# EAGLE schematic Slave Mux (EAGLE 9.6.2)
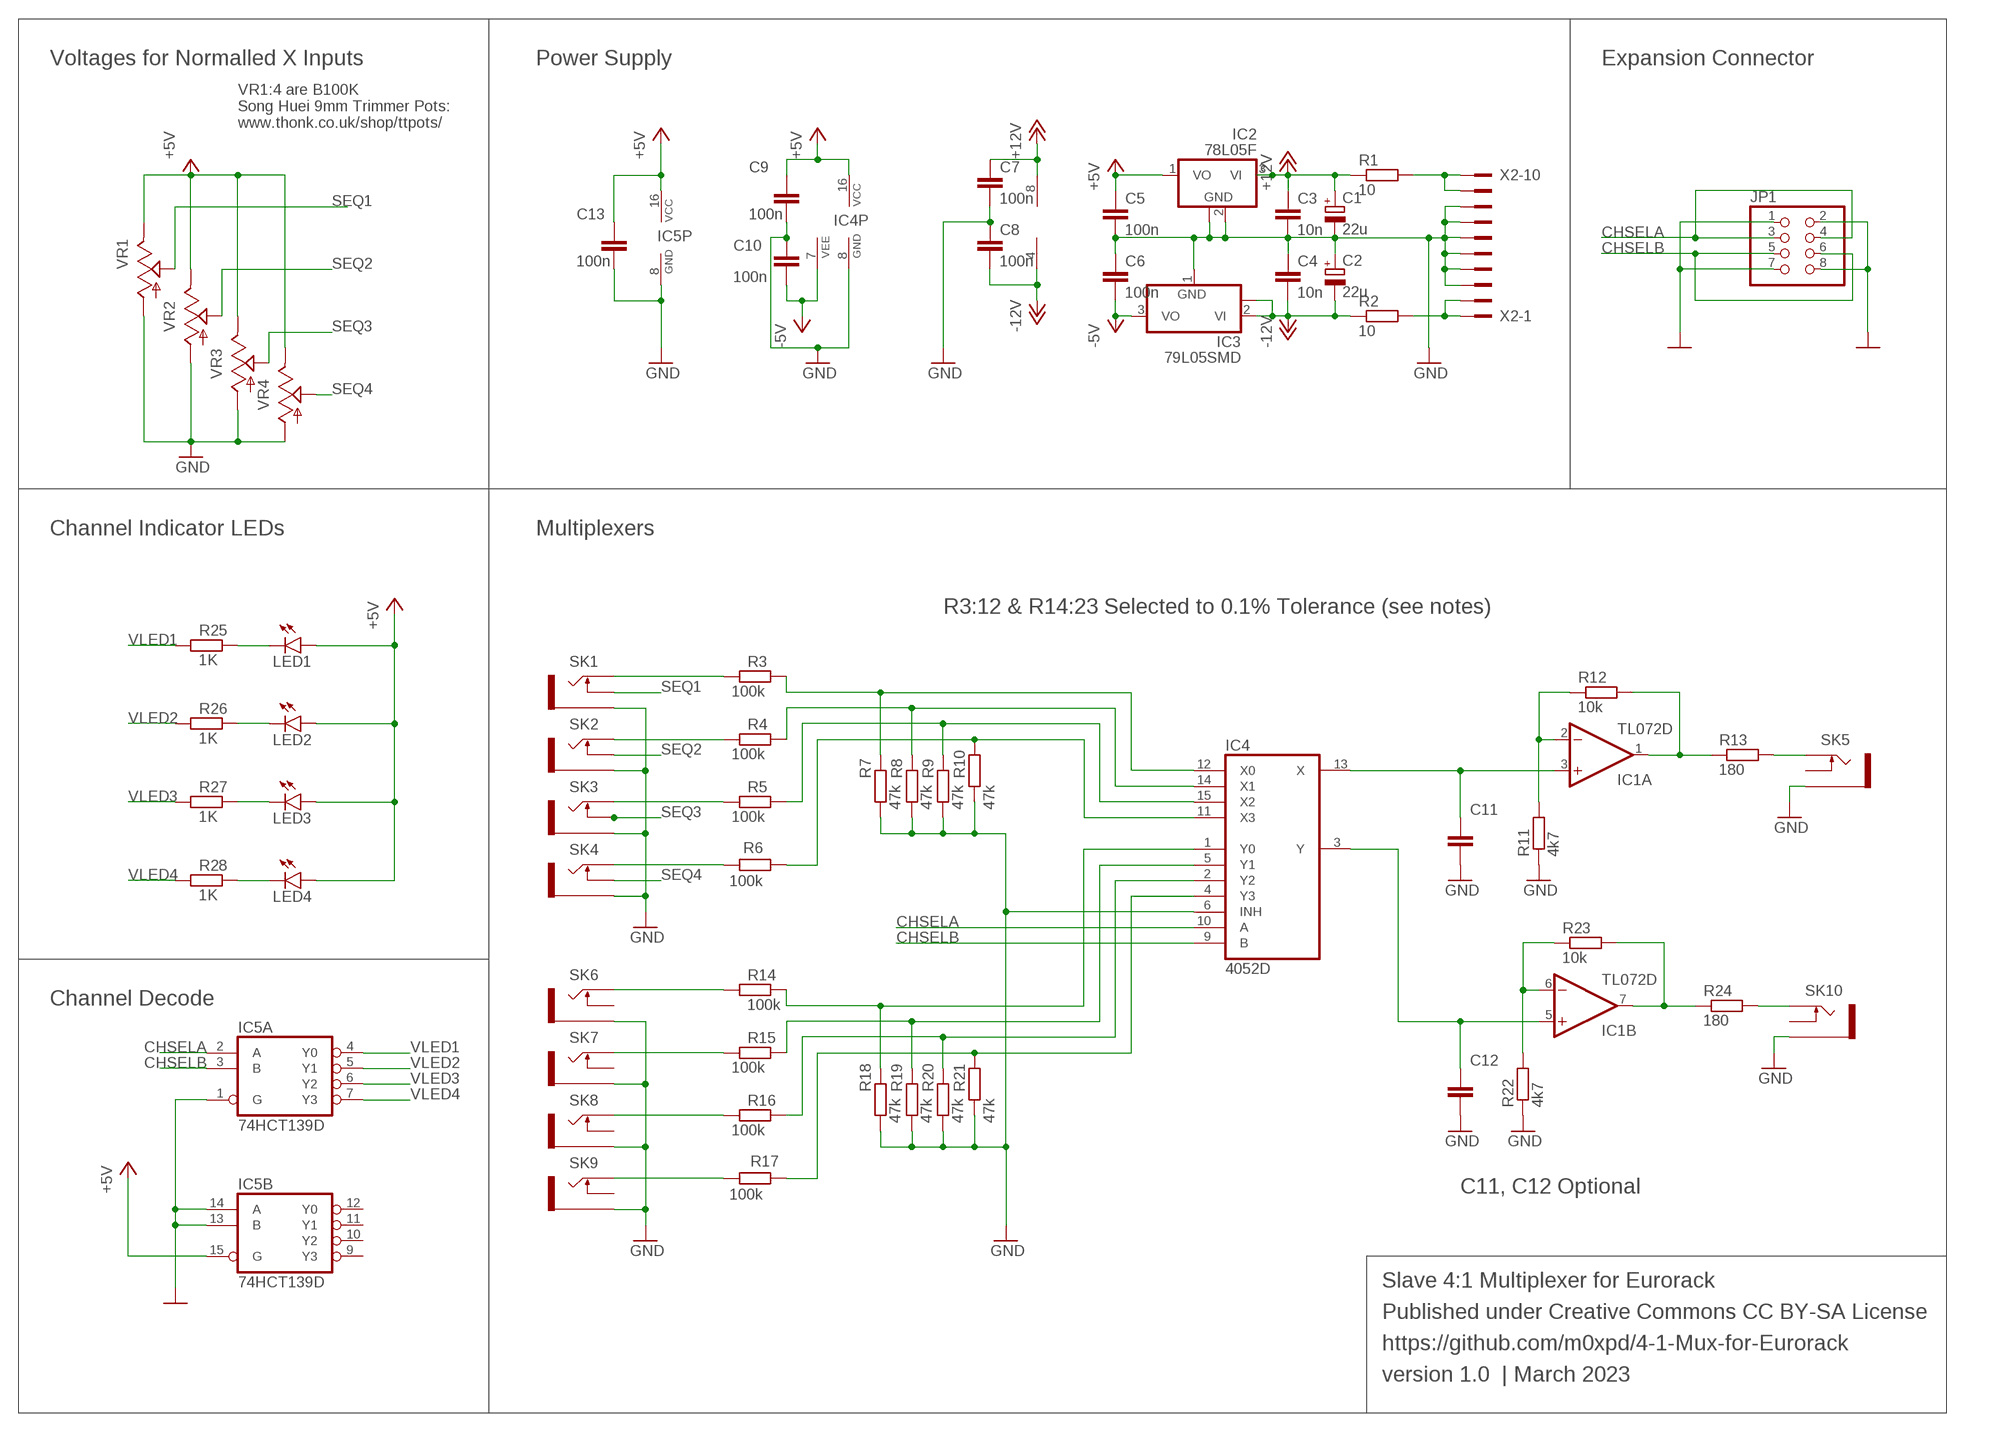
[diagram p0: schematic, sheet 1]

## Parts
C1  22u  CPOL-EU153CLV-0505  [153CLV-0505]
C2  22u  CPOL-EU153CLV-0505  [153CLV-0505]
C3  10n  C-EUC1206  [C1206]
C4  10n  C-EUC1206  [C1206]
C5  100n  C-EUC1206  [C1206]
C6  100n  C-EUC1206  [C1206]
C7  100n  C-EUC1206  [C1206]
C8  100n  C-EUC1206  [C1206]
C9  100n  C-EUC1206  [C1206]
C10  100n  C-EUC1206  [C1206]
C11  C-EUC1206  [C1206]
C12  C-EUC1206  [C1206]
C13  100n  C-EUC1206  [C1206]
IC1  TL072D  [SO08]
IC2  78L05F  [SOT89]
IC3  79L05SMD  [SOT89]
IC4  4052D  [SO16]
IC5  74HCT139D  [SO16]
JP1  PINHD-2X4  [2X04]
LED1  LED3MM  [LED3MM]
LED2  LED3MM  [LED3MM]
LED3  LED3MM  [LED3MM]
LED4  LED3MM  [LED3MM]
R1  10  R-EU_M1206  [M1206]
R2  10  R-EU_M1206  [M1206]
R3  100k  R-EU_M1206  [M1206]
R4  100k  R-EU_M1206  [M1206]
R5  100k  R-EU_M1206  [M1206]
R6  100k  R-EU_M1206  [M1206]
R7  47k  R-EU_M1206  [M1206]
R8  47k  R-EU_M1206  [M1206]
R9  47k  R-EU_M1206  [M1206]
R10  47k  R-EU_M1206  [M1206]
R11  4k7  R-EU_R1206  [R1206]
R12  10k  R-EU_R1206  [R1206]
R13  180  R-EU_M1206  [M1206]
R14  100k  R-EU_M1206  [M1206]
R15  100k  R-EU_M1206  [M1206]
R16  100k  R-EU_M1206  [M1206]
R17  100k  R-EU_M1206  [M1206]
R18  47k  R-EU_M1206  [M1206]
R19  47k  R-EU_M1206  [M1206]
R20  47k  R-EU_M1206  [M1206]
R21  47k  R-EU_M1206  [M1206]
R22  4k7  R-EU_R1206  [R1206]
R23  10k  R-EU_R1206  [R1206]
R24  180  R-EU_M1206  [M1206]
R25  1K  R-EU_M1206  [M1206]
R26  1K  R-EU_M1206  [M1206]
R27  1K  R-EU_M1206  [M1206]
R28  1K  R-EU_M1206  [M1206]
SK1  THONKICONN_JACK  [WQP-PJ301M-12_JACK]
SK2  THONKICONN_JACK  [WQP-PJ301M-12_JACK]
SK3  THONKICONN_JACK  [WQP-PJ301M-12_JACK]
SK4  THONKICONN_JACK  [WQP-PJ301M-12_JACK]
SK5  THONKICONN_JACK  [WQP-PJ301M-12_JACK]
SK6  THONKICONN_JACK  [WQP-PJ301M-12_JACK]
SK7  THONKICONN_JACK  [WQP-PJ301M-12_JACK]
SK8  THONKICONN_JACK  [WQP-PJ301M-12_JACK]
SK9  THONKICONN_JACK  [WQP-PJ301M-12_JACK]
SK10  THONKICONN_JACK  [WQP-PJ301M-12_JACK]
VR1  9MM_VERTICAL_POT  [9MM_SNAP-IN_POT]
VR2  9MM_VERTICAL_POT  [9MM_SNAP-IN_POT]
VR3  9MM_VERTICAL_POT  [9MM_SNAP-IN_POT]
VR4  9MM_VERTICAL_POT  [9MM_SNAP-IN_POT]
X2  2510-  [PAK100/2500-10]

## Nets
+5V: C5.1 C9.1 C13.1 IC2.1(VO) IC4.16(VCC) IC5.15(B:G) IC5.16(P:VCC) LED1.A LED2.A LED3.A LED4.A VR1.3(E) VR2.3(E) VR3.3(E) VR4.3(E)
+12V: C1.+ C3.1 C7.1 IC1.8(P:V+) IC2.3(VI) R1.1
-5V: C6.2 C10.2 IC3.3(VO) IC4.7(VEE)
-12V: C2.- C4.2 C8.2 IC1.4(P:V-) IC3.2(VI) IC3.2@1(VI) R2.1
CHSELA: IC4.10(A) IC5.2(A:A) JP1.3 JP1.4
CHSELB: IC4.9(B) IC5.3(A:B) JP1.5 JP1.6
GND: C1.- C2.+ C3.2 C4.1 C5.2 C6.1 C7.2 C8.1 C9.2 C10.1 C11.2 C12.2 C13.2 IC2.2(GND) IC2.2@1(GND) IC3.1(GND) IC4.6(INH) IC4.8(GND) IC5.1(A:G) IC5.8(P:GND) IC5.13(B:B) IC5.14(B:A) JP1.1 JP1.2 JP1.7 JP1.8 R7.1 R8.1 R9.1 R10.1 R11.1 R18.1 R19.1 R20.1 R21.1 R22.1 SK1.P$3_SLEEVE(SLEEVE) SK2.P$3_SLEEVE(SLEEVE) SK3.P$3_SLEEVE(SLEEVE) SK4.P$3_SLEEVE(SLEEVE) SK5.P$3_SLEEVE(SLEEVE) SK6.P$3_SLEEVE(SLEEVE) SK7.P$3_SLEEVE(SLEEVE) SK8.P$3_SLEEVE(SLEEVE) SK9.P$3_SLEEVE(SLEEVE) SK10.P$3_SLEEVE(SLEEVE) VR1.1(A) VR2.1(A) VR3.1(A) VR4.1(A) X2.3 X2.4 X2.5 X2.6 X2.7 X2.8
N$1: IC4.12(X0) R3.2 R7.2
N$2: IC4.14(X1) R4.2 R8.2
N$3: IC4.15(X2) R5.2 R9.2
N$4: C11.1 IC1.3(A:+IN) IC4.13(X)
N$5: IC1.2(A:-IN) R11.2 R12.1
N$6: IC1.1(A:OUT) R12.2 R13.1
N$7: R3.1 SK1.P$1_TIP(TIP)
N$8: IC4.11(X3) R6.1 R10.2
N$9: R4.1 SK2.P$1_TIP(TIP)
N$10: R5.1 SK3.P$1_TIP(TIP)
N$11: R6.2 SK4.P$1_TIP(TIP)
N$12: LED1.K(C) R25.2
N$13: R13.2 SK5.P$1_TIP(TIP)
N$14: IC4.1(Y0) R14.2 R18.2
N$15: R1.2 X2.9 X2.10
N$16: R2.2 X2.1 X2.2
N$17: IC4.5(Y1) R15.2 R19.2
N$18: IC4.2(Y2) R16.2 R20.2
N$19: IC4.4(Y3) R17.1 R21.2
N$20: R14.1 SK6.P$1_TIP(TIP)
N$21: R15.1 SK7.P$1_TIP(TIP)
N$22: R16.1 SK8.P$1_TIP(TIP)
N$23: R17.2 SK9.P$1_TIP(TIP)
N$24: LED4.K(C) R28.2
N$25: C12.1 IC1.5(B:+IN) IC4.3(Y)
N$26: IC1.6(B:-IN) R22.2 R23.1
N$27: IC1.7(B:OUT) R23.2 R24.1
N$28: R24.2 SK10.P$1_TIP(TIP)
N$29: LED2.K(C) R26.2
N$30: LED3.K(C) R27.2
SEQ1: SK1.P$2_SWITCH(SWITCH) VR1.2(S)
SEQ2: SK2.P$2_SWITCH(SWITCH) VR2.2(S)
SEQ3: SK3.P$2_SWITCH(SWITCH) VR3.2(S)
SEQ4: SK4.P$2_SWITCH(SWITCH) VR4.2(S)
VLED1: IC5.4(A:Y0) R25.1
VLED2: IC5.5(A:Y1) R26.1
VLED3: IC5.6(A:Y2) R27.1
VLED4: IC5.7(A:Y3) R28.1
Unconnected: IC5.9(B:Y3) IC5.10(B:Y2) IC5.11(B:Y1) IC5.12(B:Y0) SK5.P$2_SWITCH(SWITCH) SK6.P$2_SWITCH(SWITCH) SK7.P$2_SWITCH(SWITCH) SK8.P$2_SWITCH(SWITCH) SK9.P$2_SWITCH(SWITCH) SK10.P$2_SWITCH(SWITCH)

## Notes on the sheet
- Voltages for Normalled X Inputs | Power Supply | Expansion Connector
- VR1:4 are B100K
  Song Huei 9mm Trimmer Pots:
  www.thonk.co.uk/shop/ttpots/
- Channel Indicator LEDs | Multiplexers
- R3:12 & R14:23 Selected to 0.1% Tolerance (see notes)
- Channel Decode
- C11, C12 Optional
- Slave 4:1 Multiplexer for Eurorack
- Published under Creative Commons CC BY-SA License
- https://github.com/m0xpd/4-1-Mux-for-Eurorack
- version 1.0  | March 2023

## Library data of the parts
C1 C2 = rcl:CPOL-EU: POLARIZED CAPACITOR, European symbol; SPICEPREFIX: C
C3-C13 = rcl:C-EU: CAPACITOR, European symbol; SPICEPREFIX: C
IC1 = linear:TL072: OP AMP
IC2 = linear:78L*: POSITOIV-VOLTAGE REGULATORS Output up to 100 mA Source: Datasheet <http://focus.ti.com/lit/ds/symlink/ua78l05.pdf>
IC3 = MyLibrary:79L05SMD: -5V Linear Regulator with 100mA output in SOT-89 Package
IC4 = 40xx:4052: Dual 4-channel ANALOG MULTIPLEXER
IC5 = 74xx-eu:74*139: Dual 2-line to 4-line DECODER/DEMULTIPLEXER
JP1 = pinhead:PINHD-2X4: PIN HEADER
LED1-LED4 = led:LED: LED OSRAM: - CHIPLED LG R971, LG N971, LY N971, LG Q971, LY Q971, LO R971, LY R971 LH N974, LH R974 LS Q976, LO Q976, LY Q976 LO Q996 - Hyper CHIPLED LW Q18S LB Q993, LB Q99A, LB R99A - SideLED LS A670, LO A670, LY A670, LG A670, LP A670 LB A673, LV A673, LT A673, LW A673 LH A674 LY A675 LS A676, LA A676, LO A676, LY A676, LW A676 LS A679, LY A679, LG A679 - Hyper Micro SIDELED® LS Y876, LA Y876, LO Y876, LY Y876 LT Y87S - SmartLED LW L88C, LW L88S LB L89C, LB L89S, LG L890 LS L89K, LO L89K, LY L89K LS L896, LA L896, LO L896, LY L896 - TOPLED LS T670, LO T670, LY T670, LG T670, LP T670 LSG T670, LSP T670, LSY T670, LOP T670, LYG T670 LG T671, LOG T671, LSG T671 LB T673, LV T673, LT T673, LW T673 LH T674 LS T676, LA T676, LO T676, LY T676, LB T676, LH T676, LSB T676, LW T676 LB T67C, LV T67C, LT T67C, LS T67K, LO T67K, LY T67K, LW E67C LS E67B, LA E67B, LO E67B, LY E67B, LB E67C, LV E67C, LT E67C LW T67C LS T679, LY T679, LG T679 LS T770, LO T770, LY T770, LG T770, LP T770 LB T773, LV T773, LT T773, LW T773 LH T774 LS E675, LA E675, LY E675, LS T675 LS T776, LA T776, LO T776, LY T776, LB T776 LHGB T686 LT T68C, LB T68C - Hyper Mini TOPLED® LB M676 - Mini TOPLED Santana® LG M470 LS M47K, LO M47K, LY M47K Source: http://www.osram.convergy.de LUXEON: - LUMILED® LXK2-PW12-R00, LXK2-PW12-S00, LXK2-PW14-U00, LXK2-PW14-V00 LXK2-PM12-R00, LXK2-PM12-S00, LXK2-PM14-U00 LXK2-PE12-Q00, LXK2-PE12-R00, LXK2-PE12-S00, LXK2-PE14-T00, LXK2-PE14-U00 LXK2-PB12-K00, LXK2-PB12-L00, LXK2-PB12-M00, LXK2-PB14-N00, LXK2-PB14-P00, LXK2-PB14-Q00 LXK2-PR12-L00, LXK2-PR12-M00, LXK2-PR14-Q00, LXK2-PR14-R00 LXK2-PD12-Q00, LXK2-PD12-R00, LXK2-PD12-S00 LXK2-PH12-R00, LXK2-PH12-S00 LXK2-PL12-P00, LXK2-PL12-Q00, LXK2-PL12-R00 Source: www.luxeon.com KINGBRIGHT: KA-3528ASYC Source: www.kingbright.com
R1-R28 = rcl:R-EU_: RESISTOR, European symbol; SPICEPREFIX: R
SK1-SK10 = MyLibrary:THONKICONN_JACK
VR1-VR4 = MyLibrary:9MM_VERTICAL_POT
X2 = con-3m:2510-: 3M (TM) Pak 100 4-Wall Header Source: 3M; MF: 3M; MPN: 2510-6002UB; OC_FARNELL: 9838244; OC_NEWARK: 46F4725